# Altium schematic sheet [1]Supply.SchDoc
size A4; SheetNumber: 3; SheetTotal: 6
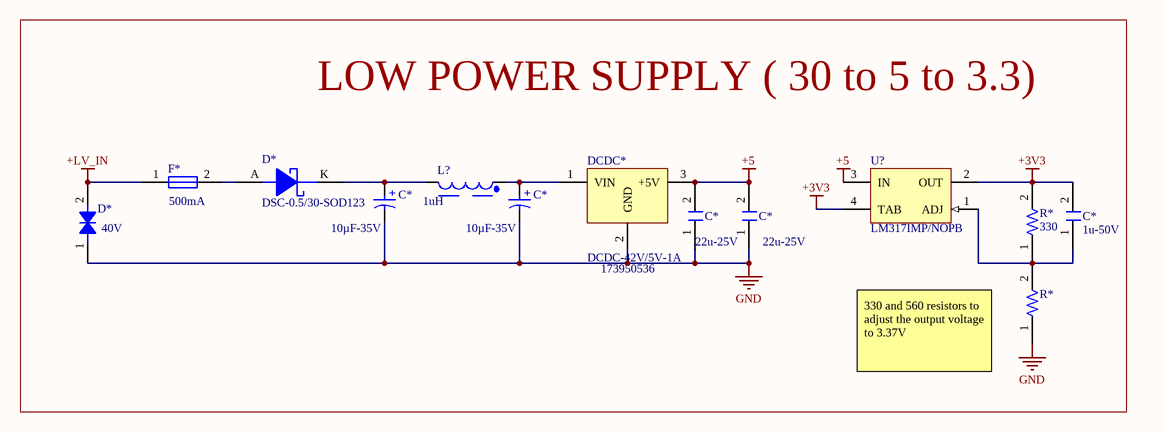
[diagram p0: [1]Supply.SchDoc]

## Parts
(Parts that share a designator on the sheet are numbered #1, #2 ... from top to bottom, then left to right.)
?  (no value)  (graphical)
C*#1  value 10µF-35V  [865080540004-Footprint-1]  (hidden comment: 865080540004)
C*#2  value 10µF-35V  [865080540004-Footprint-1]  (hidden comment: 865080540004)
C*#3  22u-25V  [0805]
C*#4  22u-25V  [0805]
C*#5  1u-50V  [C0805FNPC-R]
D*#1  DSC-0.5/30-SOD123  [DSC-SOD123]
D*#2  Capacitance: 40V  [DTVS-DO-214AB]  (hidden comment: DTVS-40V-DO-214AB)
DCDC*  DCDC-42V/5V-1A  Part Number: 173950536  [DCDC_Magi3c]
F*  Current Rating: 500mA  [0805]  (hidden comment: MFU0805FF00500P500)
L?  value 1uH  [WE-PD2_4532]  (hidden comment: 7447730)
R*#1  330  [0805]
R*#2  560  [0805]  (value not drawn)
U?  LM317IMP/NOPB  [DCY0004A_M]

## Blocks framed on the sheet
LOW POWER SUPPLY ( 30 to 5 to 3.3): C*#1-C*#5 D*#1 D*#2 DCDC* F* L? R*#1 R*#2 U?

## Nets
+3V3: C*#5.2 R*#1.2 U?.2(OUT) U?.4(TAB)
+5: C*#3.2 C*#4.2 DCDC*.3(+5V) U?.3(IN)
+LV_IN: D*#2.2 F*.1
GND: C*#1.2(N) C*#2.2(N) C*#3.1 C*#4.1 D*#2.1 DCDC*.2(GND) R*#2.1
NetC*#1_1: C*#1.1(P) D*#1.K L?.2
NetC*#2_1: C*#2.1(P) DCDC*.1(VIN) L?.1
NetC*#5_1: C*#5.1 R*#1.1 R*#2.2 U?.1(ADJ)
NetD*#1_A: D*#1.A F*.2

## Notes on the sheet
- (near R*#2) 330 and 560 resistors to adjust the output voltage to 3.37V
- Size:
- Company:
- Project:
- Page Contents:
- Variant:
- Version:
- Checked by:
- Author:
- Sheet
- Date:
- Department:
- of
- (in symbol CMP-001-00019-1) +

## Library data of the parts
? = CMP-00043-6: Standard Title Block
C*#1 C*#2 = CMP-001-00019-1: WCAP-ASLI Aluminum Electrolytic Capacitors; Tolerance: 20%; Ripple Current (AC): 90mA; Voltage Rating: 35V; Min Operating Temperature: -55°C; Max Operating Temperature: 105°C; Case/Package: Radial; Ripple Current: 90mA; Mounting Technology: Surface Mount; RoHS Compliant: Yes
C*#3 C*#4 = CMP-001-00018-1: Ceramic Capacitor, Multilayer, Ceramic, 25V, 20% +Tol, 20% -Tol, X5R, 15% TC, 22uF, Surface Mount, 1210; Value: 22µF; Min Operating Temperature: -55°C; Max Operating Temperature: 85°C; RoHS Compliant: Yes; Pins: 2; Case/Package: 1210; Mounting Technology: Surface Mount; Capacitor Type: Ceramic
C*#5 = CMP-00052-1: Multilayer Ceramic Capacitor, Wcap-Csgp Series, 1 F, 10%, X7R, 50 V, 0805 [2012 Metric] Rohs Compliant: Yes; Manufacturer Part Number 1: 885012207103; Manufacturer 1: Wurth Electronics; Voltage Rating (DC): 50V; Value: 1µF; .Creator: GP; Max Operating Temperature: 85°C; Case/Package: 0805; ComponentLink1Description: http://www.farnell.com/datasheets/1958501.pdf?src-supplier=Farnell; Design Item ID: C1u-50V-0805FNPC-X7R; ComponentLink1URL: http://www.farnell.com/datasheets/1958501.pdf?src-supplier=Farnell; ComponentLink2Description: http://www.farnell.com/datasheets/1958501.pdf?src-supplier=Element14; ComponentLink3URL: https://katalog.we-online.de/pbs/datasheet/885012107003.pdf?src-supplier=Digi-Key; ComponentLink4Description: http://www.farnell.com/datasheets/1958501.pdf?src-supplier=Newark; Width: 0.049inch; RoHS Compliant: Yes; Case Code (Metric): 2012; Source: Passives.SchLib; Category: Ceramic Capacitors; Tolerance: 10%; Pricing 1: 50=0,27200, 250=0,25300, 500=0,22800, 1250=0,20100, 2500=0,17100 (GBP); RoHS: Yes; Mount: Surface Mount; Min Operating Temperature: -55°C; ComponentLink4URL: http://www.farnell.com/datasheets/1958501.pdf?src-supplier=Newark; Dielectric: X7R; ComponentLink3Description: https://katalog.we-online.de/pbs/datasheet/885012107003.pdf?src-supplier=Digi-Key; ComponentLink2URL: http://www.farnell.com/datasheets/1958501.pdf?src-supplier=Element14; REACH SVHC: Unknown; Length: 0.079inch; Packaging: Cut Tape; Thickness: 0.053inch; Stock 1: 5100; Voltage Rating: 50V
D*#1 = CMP-00165-1: VR=30V IF=500mA 30pF P=410mW; Max Reverse Leakage Current: 130uA; .Creator: GP; Max Reverse Voltage (DC): 30V; Element Configuration: Single; Average Rectified Current: 500mA; Peak Non-Repetitive Surge Current: 5.5A; Polarity: Standard; Forward Voltage: 430mV; ComponentLink10Description: https://datasheet.ciiva.com/910/mbr0530-910518.pdf?src-supplier=Digi-Key; ComponentLink1Description: Datasheet; Category: Diode; ComponentLink3Description: https://datasheet.ciiva.com/30479/0900766b810e2512-30479401.pdf?src-supplier=RSComponents; ComponentLink5Description: https://datasheet.ciiva.com/910/mbr0530-910516.pdf?src-supplier=Digi-Key; Stock 1: 9; Weight: 0.03g; Source: Filter components.SchLib; ComponentLink2Description: Where buy it; Series: -; Mount: Surface Mount; Max Repetitive Reverse Voltage (Vrrm): 30V; Pricing 1: 1=0,34400, 10=0,23900, 100=0,12200, 500=0,10000 (USD); Design Item ID: DSC-0.5/30-SOD123; ComponentLink8Description: https://datasheet.ciiva.com/17318/mbr0530-17318568.pdf?src-supplier=Future+Electronics; Current Rating: 500mA; ComponentLink1URL: *; Length: 2.7mm; Max Reverse Current: 130uA; ComponentLink7URL: https://datasheet.ciiva.com/8300/mbr0530-8300905.pdf?src-supplier=Avnet; ComponentLink9URL: https://datasheet.ciiva.com/15144/getdatasheetpartid-86760-15144598.pdf?src-supplier=Verical; Radiation Hardening: No; Height: 1.03mm; ComponentLink4Description: https://datasheet.ciiva.com/34301/974753-34301826.pdf?src-supplier=Jameco; ComponentLink7Description: https://datasheet.ciiva.com/8300/mbr0530-8300905.pdf?src-supplier=Avnet; Package Quantity: 1; Forward Current: 500mA; ComponentLink5URL: https://datasheet.ciiva.com/910/mbr0530-910516.pdf?src-supplier=Digi-Key; Max Surge Current: 5.5A; Lead Free: Lead Free; ComponentLink2URL: *; Max Forward Surge Current (Ifsm): 5.5A; Output Current: 500mA; Voltage Rating (DC): 30V; Contact Plating: Tin,Matte; RoHS Compliant: Yes; REACH SVHC: No SVHC; ComponentLink10URL: https://datasheet.ciiva.com/910/mbr0530-910518.pdf?src-supplier=Digi-Key; ComponentLink4URL: https://datasheet.ciiva.com/34301/974753-34301826.pdf?src-supplier=Jameco; ComponentLink6URL: https://datasheet.ciiva.com/25931/mbr0530-25931989.pdf?src-supplier=Avnet+Europe; ComponentLink6Description: https://datasheet.ciiva.com/25931/mbr0530-25931989.pdf?src-supplier=Avnet+Europe; Width: 1.6mm; ComponentLink3URL: https://datasheet.ciiva.com/30479/0900766b810e2512-30479401.pdf?src-supplier=RSComponents; ComponentLink9Description: https://datasheet.ciiva.com/15144/getdatasheetpartid-86760-15144598.pdf?src-supplier=Verical; ComponentLink8URL: https://datasheet.ciiva.com/17318/mbr0530-17318568.pdf?src-supplier=Future+Electronics
D*#2 = CMP-00157-1: TVS diode [Würth Elektronik] 824551301 TVS diode; Manufacturer: Wurth Electronics; Number of Bidirectional Channels: 1; .Creator: DO; Peak Pulse Current: 62A; Power Line Protection: No; Forward Voltage: 35.05V; Polarity: Bidirectional; Reverse Standoff Voltage: 30V; Peak Pulse Power: 3kW; Clamping Voltage: 48.4V; Stock 1: 1; Category: TVS Diodes; Manufacturer Part Number: 824551301; Resistor Type: Zener; Design Item ID: DTVS-40V-DO-214AB; ComponentLink1URL: http://www.farnell.com/datasheets/2036459.pdf?src-supplier=Element14; Min Operating Temperature: -65°C; ComponentLink2Description: Where buy it; RoHS: Yes; REACH SVHC: Unknown; Pins: 2; ComponentLink2URL: https://www.we-online.com/catalog/en/WE-TVSP?sq=824551301#824551301; Min Breakdown Voltage: 35.05V; RoHS Compliant: Yes; Pricing 1: 10=1,72500, 50=1,54700, 100=1,45300, 250=1,35100, 500=1,15000 (USD); Max Operating Temperature: 150°C; Packaging: Cut Tape; Source: Filter components.SchLib; ComponentLink1Description: http://www.farnell.com/datasheets/2036459.pdf?src-supplier=Element14; Mount: Surface Mount
DCDC* = CMP-00116-1: Würth Elektronik 8-42V to 5V 1A DC-DC; Manufacturer 1: Wurth Electronics; Manufacturer Part Number 1: 173010542; Efficiency: 93%; Min Input Voltage: 8V; .Creator: DR; Max Input Voltage: 42V; Number of Outputs: 1; Packaging: Rail/Tube; RoHS Compliant: Yes; RoHS: Yes; Voltage - Output 1: 5V; Stock 1: 1; ComponentLink3Description: https://katalog.we-online.de/pm/datasheet/173010542.pdf?src-supplier=Digi-Key; Max Output Current: 1A; Min Operating Temperature: -40°C; Features: UVLO,OCP,OTP,SCP; Design Item ID: DCDC-42V/5V-1A; Pricing 1: 1=12,22500, 8=10,96900, 21=10,68900 (USD); ComponentLink3URL: https://katalog.we-online.de/pm/datasheet/173010542.pdf?src-supplier=Digi-Key; Max Operating Temperature: 85°C; ComponentLink2Description: http://www.farnell.com/datasheets/2192895.pdf?src-supplier=Newark; ComponentLink1URL: http://www.farnell.com/datasheets/2192895.pdf?src-supplier=Farnell; ComponentLink1Description: http://www.farnell.com/datasheets/2192895.pdf?src-supplier=Farnell; Source: Semiconductor.SchLib; ComponentLink2URL: http://www.farnell.com/datasheets/2192895.pdf?src-supplier=Newark; Mount: Through Hole
F* = CMP-001-00020-1: Fuse, 24 Milliohms to 660 Milliohms (Cold) @ 0.1, 32 V, 0805, 15 C, 35 C; Value: 0.5A-50V; Max Operating Temperature: 125°C; Pins: 2; Case/Package: 0805; Mounting Technology: Surface Mount,PCB; RoHS Compliant: Yes; Min Operating Temperature: 15°C
L? = CMP-006-00005-1: General Purpose Inductor, 1uH, 20%, 1 Element, Nickel-zinc Ferrite-Core, SMD, 1816; Self Resonant Frequency: 110MHz; Max Current Rating: 4A; RoHS Compliant: Yes; Tolerance: 20%; Min Operating Temperature: -40°C; Pins: 2; Max Operating Temperature: 125°C
R*#1 = CMP-009-00024-1: Fixed Resistor, Metal Glaze/thick Film, 0.5W, 330ohm, 150V, 1% +/-Tol, 100ppm/Cel, Surface Mount, 0805; Power: 500mW; Max Operating Temperature: 155°C; Min Operating Temperature: -55°C; Pins: 2; RoHS Compliant: Yes; Value: 330; Case/Package: 0805; Mounting Technology: Surface Mount; Tolerance: 1%
R*#2 = CMP-009-00025-1: Fixed Resistor, Metal Glaze/thick Film, 0.5W, 560ohm, 150V, 1% +/-Tol, 100ppm/Cel, Surface Mount, 0805; Power: 500mW; Mounting Technology: Surface Mount; Tolerance: 1%; Case/Package: 0805; Max Operating Temperature: 155°C; RoHS Compliant: Yes; Min Operating Temperature: -55°C; Pins: 2; Value: 560
U? = CMP-019-00004-1: Linear Voltage Regulator IC Positive Adjustable 1 Output 1.25 V ~ 37 V 1A SOT-223-4